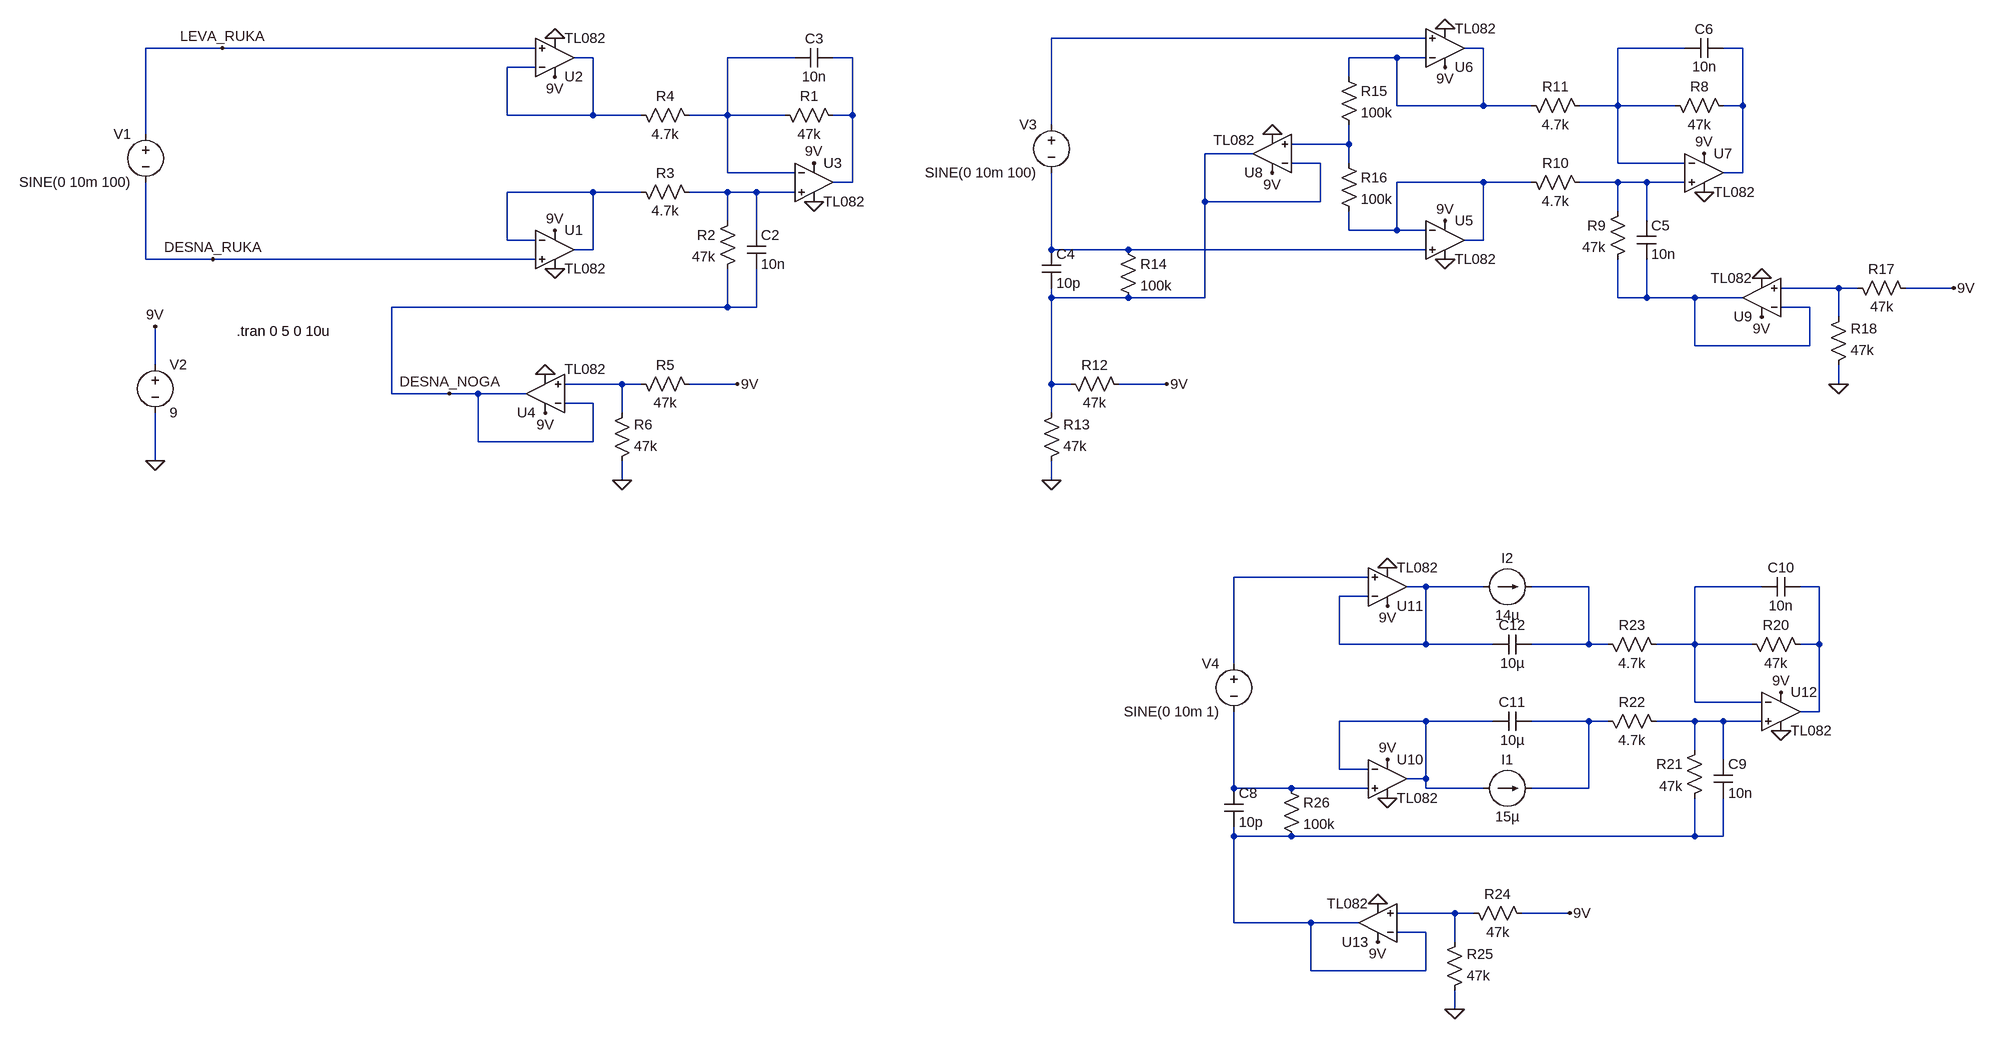
[diagram p0: schematic testirana_sema_TL072.asc]
testirana_sema_TL072.asc, the LTspice schematic file:
Version 4
SHEET 1 2656 1556
WIRE 1728 -192 1104 -192
WIRE -400 -176 -528 -176
WIRE 144 -176 -400 -176
WIRE 1824 -176 1792 -176
WIRE 2160 -176 2048 -176
WIRE 2256 -176 2224 -176
WIRE 240 -160 208 -160
WIRE 576 -160 464 -160
WIRE 672 -160 640 -160
WIRE 1680 -160 1600 -160
WIRE 1728 -160 1680 -160
WIRE 144 -144 96 -144
WIRE 1600 -128 1600 -160
WIRE 1680 -80 1680 -160
WIRE 1824 -80 1824 -176
WIRE 1824 -80 1680 -80
WIRE 1904 -80 1824 -80
WIRE 2048 -80 2048 -176
WIRE 2048 -80 1984 -80
WIRE 2144 -80 2048 -80
WIRE 2256 -80 2256 -176
WIRE 2256 -80 2224 -80
WIRE 96 -64 96 -144
WIRE 240 -64 240 -160
WIRE 240 -64 96 -64
WIRE 320 -64 240 -64
WIRE 464 -64 464 -160
WIRE 464 -64 400 -64
WIRE 560 -64 464 -64
WIRE 672 -64 672 -160
WIRE 672 -64 640 -64
WIRE 1104 -48 1104 -192
WIRE -528 -32 -528 -176
WIRE 1600 -16 1600 -48
WIRE 1600 -16 1504 -16
WIRE 1440 0 1360 0
WIRE 1552 16 1504 16
WIRE 1600 16 1600 -16
WIRE 2048 16 2048 -80
WIRE 2160 16 2048 16
WIRE 464 32 464 -64
WIRE 576 32 464 32
WIRE 2256 32 2256 -80
WIRE 2256 32 2224 32
WIRE 672 48 672 -64
WIRE 672 48 640 48
WIRE 1824 48 1680 48
WIRE 1904 48 1824 48
WIRE 2048 48 1984 48
WIRE 2096 48 2048 48
WIRE 2160 48 2096 48
WIRE 240 64 96 64
WIRE 320 64 240 64
WIRE 464 64 400 64
WIRE 512 64 464 64
WIRE 576 64 512 64
WIRE 1360 80 1360 0
WIRE 1552 80 1552 16
WIRE 1552 80 1360 80
WIRE 2048 96 2048 48
WIRE 464 112 464 64
WIRE 2096 112 2096 48
WIRE 512 128 512 64
WIRE 1600 128 1600 96
WIRE 1680 128 1680 48
WIRE 1680 128 1600 128
WIRE 1728 128 1680 128
WIRE 96 144 96 64
WIRE 144 144 96 144
WIRE 1824 144 1824 48
WIRE 1824 144 1792 144
WIRE 240 160 240 64
WIRE 240 160 208 160
WIRE 1104 160 1104 32
WIRE 1232 160 1104 160
WIRE 1728 160 1232 160
WIRE -528 176 -528 48
WIRE -416 176 -528 176
WIRE 144 176 -416 176
WIRE 2416 224 2320 224
WIRE 2448 224 2416 224
WIRE 2608 224 2528 224
WIRE 1104 240 1104 224
WIRE 1232 240 1104 240
WIRE 1360 240 1360 80
WIRE 1360 240 1232 240
WIRE 2048 240 2048 176
WIRE 2096 240 2096 176
WIRE 2096 240 2048 240
WIRE 2176 240 2096 240
WIRE 2256 240 2176 240
WIRE 464 256 464 192
WIRE 464 256 -96 256
WIRE 512 256 512 192
WIRE 512 256 464 256
WIRE 2368 256 2320 256
WIRE 2416 272 2416 224
WIRE 2176 320 2176 240
WIRE 2368 320 2368 256
WIRE 2368 320 2176 320
WIRE -512 352 -512 288
WIRE 288 384 192 384
WIRE 320 384 288 384
WIRE 480 384 400 384
WIRE 1104 384 1104 240
WIRE 1136 384 1104 384
WIRE 1296 384 1216 384
WIRE 2416 384 2416 352
WIRE -96 400 -96 256
WIRE 0 400 -96 400
WIRE 48 400 0 400
WIRE 128 400 48 400
WIRE 240 416 192 416
WIRE 288 432 288 384
WIRE 1104 432 1104 384
WIRE 48 480 48 400
WIRE 240 480 240 416
WIRE 240 480 48 480
WIRE -512 512 -512 432
WIRE 288 544 288 512
WIRE 1104 544 1104 512
WIRE 1632 816 1408 816
WIRE 1728 832 1696 832
WIRE 1824 832 1728 832
WIRE 2000 832 1904 832
WIRE 2288 832 2176 832
WIRE 2384 832 2352 832
WIRE 1632 848 1584 848
WIRE 1584 928 1584 848
WIRE 1728 928 1728 832
WIRE 1728 928 1584 928
WIRE 1840 928 1728 928
WIRE 2000 928 2000 832
WIRE 2000 928 1904 928
WIRE 2032 928 2000 928
WIRE 2176 928 2176 832
WIRE 2176 928 2112 928
WIRE 2272 928 2176 928
WIRE 2384 928 2384 832
WIRE 2384 928 2352 928
WIRE 1408 960 1408 816
WIRE 2176 1024 2176 928
WIRE 2288 1024 2176 1024
WIRE 2384 1040 2384 928
WIRE 2384 1040 2352 1040
WIRE 1728 1056 1584 1056
WIRE 1840 1056 1728 1056
WIRE 2000 1056 1904 1056
WIRE 2032 1056 2000 1056
WIRE 2176 1056 2112 1056
WIRE 2224 1056 2176 1056
WIRE 2288 1056 2224 1056
WIRE 2176 1104 2176 1056
WIRE 2224 1120 2224 1056
WIRE 1584 1136 1584 1056
WIRE 1632 1136 1584 1136
WIRE 1728 1152 1728 1056
WIRE 1728 1152 1696 1152
WIRE 1408 1168 1408 1040
WIRE 1504 1168 1408 1168
WIRE 1632 1168 1504 1168
WIRE 1728 1168 1728 1152
WIRE 1824 1168 1728 1168
WIRE 2000 1168 2000 1056
WIRE 2000 1168 1904 1168
WIRE 1408 1248 1408 1232
WIRE 1504 1248 1408 1248
WIRE 2176 1248 2176 1184
WIRE 2176 1248 1504 1248
WIRE 2224 1248 2224 1184
WIRE 2224 1248 2176 1248
WIRE 1776 1376 1680 1376
WIRE 1808 1376 1776 1376
WIRE 1968 1376 1888 1376
WIRE 1408 1392 1408 1248
WIRE 1536 1392 1408 1392
WIRE 1616 1392 1536 1392
WIRE 1728 1408 1680 1408
WIRE 1776 1424 1776 1376
WIRE 1536 1472 1536 1392
WIRE 1728 1472 1728 1408
WIRE 1728 1472 1536 1472
WIRE 1776 1536 1776 1504
FLAG 176 -192 0
FLAG 176 192 0
FLAG 176 -128 9V
FLAG 176 128 9V
FLAG -512 512 0
FLAG -512 288 9V
FLAG 608 80 0
FLAG 608 16 9V
FLAG 160 368 0
FLAG 160 432 9V
FLAG 480 384 9V
FLAG 288 544 0
FLAG 1760 -208 0
FLAG 1760 176 0
FLAG 1760 -144 9V
FLAG 1760 112 9V
FLAG 2192 64 0
FLAG 2192 0 9V
FLAG 1472 -32 0
FLAG 1472 32 9V
FLAG 1296 384 9V
FLAG 1104 544 0
FLAG 2288 208 0
FLAG 2288 272 9V
FLAG 2608 224 9V
FLAG 2416 384 0
FLAG 1664 800 0
FLAG 1664 1184 0
FLAG 1664 864 9V
FLAG 1664 1120 9V
FLAG 2320 1072 0
FLAG 2320 1008 9V
FLAG 1648 1360 0
FLAG 1648 1424 9V
FLAG 1968 1376 9V
FLAG 1776 1536 0
FLAG 0 400 DESNA_NOGA
FLAG -400 -176 LEVA_RUKA
FLAG -416 176 DESNA_RUKA
SYMBOL ZZZ\\OpAmp\\TL082 176 160 R0
SYMATTR InstName U1
SYMBOL ZZZ\\OpAmp\\TL082 176 -160 M180
SYMATTR InstName U2
SYMBOL voltage -528 -48 M0
WINDOW 123 0 0 Left 0
WINDOW 39 0 0 Left 0
SYMATTR InstName V1
SYMATTR Value SINE(0 10m 100)
SYMBOL voltage -512 336 R0
WINDOW 123 0 0 Left 0
WINDOW 39 0 0 Left 0
SYMATTR InstName V2
SYMATTR Value 9
SYMBOL ZZZ\\OpAmp\\TL082 608 48 R0
SYMATTR InstName U3
SYMBOL res 544 -80 M90
WINDOW 0 0 56 VBottom 2
WINDOW 3 32 56 VTop 2
SYMATTR InstName R1
SYMATTR Value 47k
SYMBOL res 480 96 M0
SYMATTR InstName R2
SYMATTR Value 47k
SYMBOL res 416 80 M270
WINDOW 0 32 56 VTop 2
WINDOW 3 0 56 VBottom 2
SYMATTR InstName R3
SYMATTR Value 4.7k
SYMBOL res 416 -48 M270
WINDOW 0 32 56 VTop 2
WINDOW 3 0 56 VBottom 2
SYMATTR InstName R4
SYMATTR Value 4.7k
SYMBOL ZZZ\\OpAmp\\TL082 160 400 R180
WINDOW 3 -101 41 Left 2
SYMATTR InstName U4
SYMBOL res 416 400 M270
WINDOW 0 32 56 VTop 2
WINDOW 3 0 56 VBottom 2
SYMATTR InstName R5
SYMATTR Value 47k
SYMBOL res 272 528 M180
WINDOW 0 36 76 Left 2
WINDOW 3 36 40 Left 2
SYMATTR InstName R6
SYMATTR Value 47k
SYMBOL cap 496 128 R0
SYMATTR InstName C2
SYMATTR Value 10n
SYMBOL cap 640 -176 R90
WINDOW 0 0 32 VBottom 2
WINDOW 3 32 32 VTop 2
SYMATTR InstName C3
SYMATTR Value 10n
SYMBOL ZZZ\\OpAmp\\TL082 1760 144 R0
SYMATTR InstName U5
SYMBOL ZZZ\\OpAmp\\TL082 1760 -176 M180
SYMATTR InstName U6
SYMBOL voltage 1104 -64 M0
WINDOW 123 0 0 Left 0
WINDOW 39 0 0 Left 0
SYMATTR InstName V3
SYMATTR Value SINE(0 10m 100)
SYMBOL ZZZ\\OpAmp\\TL082 2192 32 R0
SYMATTR InstName U7
SYMBOL res 2128 -96 M90
WINDOW 0 0 56 VBottom 2
WINDOW 3 32 56 VTop 2
SYMATTR InstName R8
SYMATTR Value 47k
SYMBOL res 2064 80 M0
SYMATTR InstName R9
SYMATTR Value 47k
SYMBOL res 2000 64 M270
WINDOW 0 32 56 VTop 2
WINDOW 3 0 56 VBottom 2
SYMATTR InstName R10
SYMATTR Value 4.7k
SYMBOL res 2000 -64 M270
WINDOW 0 32 56 VTop 2
WINDOW 3 0 56 VBottom 2
SYMATTR InstName R11
SYMATTR Value 4.7k
SYMBOL ZZZ\\OpAmp\\TL082 1472 0 R180
WINDOW 3 29 22 Left 2
SYMATTR InstName U8
SYMBOL res 1232 400 M270
WINDOW 0 32 56 VTop 2
WINDOW 3 0 56 VBottom 2
SYMATTR InstName R12
SYMATTR Value 47k
SYMBOL res 1088 528 M180
WINDOW 0 36 76 Left 2
WINDOW 3 36 40 Left 2
SYMATTR InstName R13
SYMATTR Value 47k
SYMBOL cap 1088 160 R0
SYMATTR InstName C4
SYMATTR Value 10p
SYMBOL res 1216 144 R0
SYMATTR InstName R14
SYMATTR Value 100k
SYMBOL cap 2080 112 R0
SYMATTR InstName C5
SYMATTR Value 10n
SYMBOL cap 2224 -192 R90
WINDOW 0 0 32 VBottom 2
WINDOW 3 32 32 VTop 2
SYMATTR InstName C6
SYMATTR Value 10n
SYMBOL res 1584 -144 R0
SYMATTR InstName R15
SYMATTR Value 100k
SYMBOL res 1584 0 R0
SYMATTR InstName R16
SYMATTR Value 100k
SYMBOL ZZZ\\OpAmp\\TL082 2288 240 R180
SYMATTR InstName U9
SYMBOL res 2544 240 M270
WINDOW 0 32 56 VTop 2
WINDOW 3 0 56 VBottom 2
SYMATTR InstName R17
SYMATTR Value 47k
SYMBOL res 2400 368 M180
WINDOW 0 36 76 Left 2
WINDOW 3 36 40 Left 2
SYMATTR InstName R18
SYMATTR Value 47k
SYMBOL ZZZ\\OpAmp\\TL082 1664 1152 R0
SYMATTR InstName U10
SYMBOL ZZZ\\OpAmp\\TL082 1664 832 M180
SYMATTR InstName U11
SYMBOL voltage 1408 944 M0
WINDOW 123 0 0 Left 0
WINDOW 39 0 0 Left 0
SYMATTR InstName V4
SYMATTR Value SINE(0 10m 1)
SYMBOL ZZZ\\OpAmp\\TL082 2320 1040 R0
SYMATTR InstName U12
SYMBOL res 2256 912 M90
WINDOW 0 0 56 VBottom 2
WINDOW 3 32 56 VTop 2
SYMATTR InstName R20
SYMATTR Value 47k
SYMBOL res 2192 1088 M0
SYMATTR InstName R21
SYMATTR Value 47k
SYMBOL res 2128 1072 M270
WINDOW 0 32 56 VTop 2
WINDOW 3 0 56 VBottom 2
SYMATTR InstName R22
SYMATTR Value 4.7k
SYMBOL res 2128 944 M270
WINDOW 0 32 56 VTop 2
WINDOW 3 0 56 VBottom 2
SYMATTR InstName R23
SYMATTR Value 4.7k
SYMBOL ZZZ\\OpAmp\\TL082 1648 1392 R180
SYMATTR InstName U13
SYMBOL res 1904 1392 M270
WINDOW 0 32 56 VTop 2
WINDOW 3 0 56 VBottom 2
SYMATTR InstName R24
SYMATTR Value 47k
SYMBOL res 1760 1520 M180
WINDOW 0 36 76 Left 2
WINDOW 3 36 40 Left 2
SYMATTR InstName R25
SYMATTR Value 47k
SYMBOL cap 1392 1168 R0
SYMATTR InstName C8
SYMATTR Value 10p
SYMBOL res 1488 1152 R0
SYMATTR InstName R26
SYMATTR Value 100k
SYMBOL cap 2208 1120 R0
SYMATTR InstName C9
SYMATTR Value 10n
SYMBOL cap 2352 816 R90
WINDOW 0 0 32 VBottom 2
WINDOW 3 32 32 VTop 2
SYMATTR InstName C10
SYMATTR Value 10n
SYMBOL cap 1904 1040 R90
WINDOW 0 0 32 VBottom 2
WINDOW 3 32 32 VTop 2
SYMATTR InstName C11
SYMATTR Value 10µ
SYMBOL cap 1904 912 R90
WINDOW 0 0 32 VBottom 2
WINDOW 3 32 32 VTop 2
SYMATTR InstName C12
SYMATTR Value 10µ
SYMBOL current 1824 1168 R270
WINDOW 0 32 40 VTop 2
WINDOW 3 -32 40 VBottom 2
WINDOW 123 0 0 Left 0
WINDOW 39 0 0 Left 0
SYMATTR InstName I1
SYMATTR Value 15µ
SYMBOL current 1824 832 R270
WINDOW 0 32 40 VTop 2
WINDOW 3 -32 40 VBottom 2
WINDOW 123 0 0 Left 0
WINDOW 39 0 0 Left 0
SYMATTR InstName I2
SYMATTR Value 14µ
TEXT -376 296 Left 2 !.tran 0 5 0 10u

The netlist it stands for:
* testirana_sema_TL072.asc
* U1: TL082 (symbol ZZZ\OpAmp\TL082 not available, pins judged from their places): In+=DESNA_RUKA In-=N012 V+=9V V-=0 OUT=N012
* U2: TL082 (symbol ZZZ\OpAmp\TL082 not available, pins judged from their places): In+=LEVA_RUKA In-=N005 V+=9V V-=0 OUT=N005
V1 LEVA_RUKA DESNA_RUKA SINE(0 10m 100)
V2 9V 0 9
* U3: TL082 (symbol ZZZ\OpAmp\TL082 not available, pins judged from their places): In+=N013 In-=N006 V+=9V V-=0 OUT=N007
R1 N006 N007 47k
R2 N013 DESNA_NOGA 47k
R3 N013 N012 4.7k
R4 N006 N005 4.7k
* U4: TL082 (symbol ZZZ\OpAmp\TL082 not available, pins judged from their places): In+=N017 In-=DESNA_NOGA V+=9V V-=0 OUT=DESNA_NOGA
R5 9V N017 47k
R6 0 N017 47k
C2 N013 DESNA_NOGA 10n
C3 N007 N006 10n
* U5: TL082 (symbol ZZZ\OpAmp\TL082 not available, pins judged from their places): In+=N014 In-=N010 V+=9V V-=0 OUT=N010
* U6: TL082 (symbol ZZZ\OpAmp\TL082 not available, pins judged from their places): In+=N001 In-=N002 V+=9V V-=0 OUT=N002
V3 N001 N014 SINE(0 10m 100)
* U7: TL082 (symbol ZZZ\OpAmp\TL082 not available, pins judged from their places): In+=N011 In-=N003 V+=9V V-=0 OUT=N004
R8 N003 N004 47k
R9 N011 N016 47k
R10 N011 N010 4.7k
R11 N003 N002 4.7k
* U8: TL082 (symbol ZZZ\OpAmp\TL082 not available, pins judged from their places): In+=N008 In-=N009 V+=9V V-=0 OUT=N009
R12 9V N009 47k
R13 0 N009 47k
C4 N014 N009 10p
R14 N014 N009 100k
C5 N011 N016 10n
C6 N004 N003 10n
R15 N002 N008 100k
R16 N008 N010 100k
* U9: TL082 (symbol ZZZ\OpAmp\TL082 not available, pins judged from their places): In+=N015 In-=N016 V+=9V V-=0 OUT=N016
R17 9V N015 47k
R18 0 N015 47k
* U10: TL082 (symbol ZZZ\OpAmp\TL082 not available, pins judged from their places): In+=N026 In-=N023 V+=9V V-=0 OUT=N023
* U11: TL082 (symbol ZZZ\OpAmp\TL082 not available, pins judged from their places): In+=N018 In-=N019 V+=9V V-=0 OUT=N019
V4 N018 N026 SINE(0 10m 1)
* U12: TL082 (symbol ZZZ\OpAmp\TL082 not available, pins judged from their places): In+=N025 In-=N021 V+=9V V-=0 OUT=N022
R20 N021 N022 47k
R21 N025 N027 47k
R22 N025 N024 4.7k
R23 N021 N020 4.7k
* U13: TL082 (symbol ZZZ\OpAmp\TL082 not available, pins judged from their places): In+=N028 In-=N027 V+=9V V-=0 OUT=N027
R24 9V N028 47k
R25 0 N028 47k
C8 N026 N027 10p
R26 N026 N027 100k
C9 N025 N027 10n
C10 N022 N021 10n
C11 N024 N023 10µ
C12 N020 N019 10µ
I1 N023 N024 15µ
I2 N019 N020 14µ
.tran 0 5 0 10u
.backanno
.end